# EAGLE design power_suply_unit (EAGLE 9.4.2)
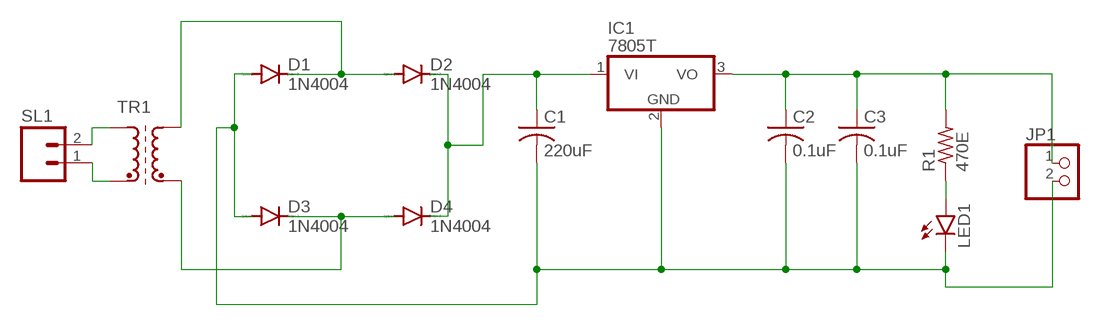
[diagram p0: schematic, sheet 1]

## Parts
C1  220uF  C-US025-024X044  [C025-024X044]
C2  0.1uF  C-US025-024X044  [C025-024X044]
C3  0.1uF  C-US025-024X044  [C025-024X044]
D1  1N4004  [DO41-10]
D2  1N4004  [DO41-10]
D3  1N4004  [DO41-10]
D4  1N4004  [DO41-10]
IC1  7805T  [TO220H]
JP1  PINHD-1X2  [1X02]
LED1  LED3MM  [LED3MM]
R1  470E  R-US_0204/7  [0204/7]
SL1  M02  [02P]
TR1  SM-T4  [SM-T4]

## Nets
N$1: SL1.2 TR1.1(A1)
N$2: SL1.1 TR1.2(E1)
N$3: D1.C D2.A TR1.5(A2)
N$4: D3.C D4.A TR1.4(E2)
N$6: C1.1 D2.C D4.C IC1.1(VI)
N$7: LED1.A R1.1
N$8: C2.1 C3.1 IC1.3(VO) JP1.1 R1.2
N$9: C1.2 C2.2 C3.2 D1.A D3.A IC1.2(GND) JP1.2 LED1.K(C)

## Library data of the parts
C1-C3 = rcl:C-US: CAPACITOR, American symbol; SPICEPREFIX: C
D1-D4 = diode:1N4004: DIODE general purpose rectifier, 1 A
IC1 = linear:78*: Positive VOLTAGE REGULATOR Source: http://cache.national.com/ds/LM/LM78L05.pdf http://www.fairchildsemi.com/ds/LM/LM7805.pdf
JP1 = pinhead:PINHD-1X2: PIN HEADER
LED1 = led:LED: LED OSRAM: - CHIPLED LG R971, LG N971, LY N971, LG Q971, LY Q971, LO R971, LY R971 LH N974, LH R974 LS Q976, LO Q976, LY Q976 LO Q996 - Hyper CHIPLED LW Q18S LB Q993, LB Q99A, LB R99A - SideLED LS A670, LO A670, LY A670, LG A670, LP A670 LB A673, LV A673, LT A673, LW A673 LH A674 LY A675 LS A676, LA A676, LO A676, LY A676, LW A676 LS A679, LY A679, LG A679 - Hyper Micro SIDELED® LS Y876, LA Y876, LO Y876, LY Y876 LT Y87S - SmartLED LW L88C, LW L88S LB L89C, LB L89S, LG L890 LS L89K, LO L89K, LY L89K LS L896, LA L896, LO L896, LY L896 - TOPLED LS T670, LO T670, LY T670, LG T670, LP T670 LSG T670, LSP T670, LSY T670, LOP T670, LYG T670 LG T671, LOG T671, LSG T671 LB T673, LV T673, LT T673, LW T673 LH T674 LS T676, LA T676, LO T676, LY T676, LB T676, LH T676, LSB T676, LW T676 LB T67C, LV T67C, LT T67C, LS T67K, LO T67K, LY T67K, LW E67C LS E67B, LA E67B, LO E67B, LY E67B, LB E67C, LV E67C, LT E67C LW T67C LS T679, LY T679, LG T679 LS T770, LO T770, LY T770, LG T770, LP T770 LB T773, LV T773, LT T773, LW T773 LH T774 LS E675, LA E675, LY E675, LS T675 LS T776, LA T776, LO T776, LY T776, LB T776 LHGB T686 LT T68C, LB T68C - Hyper Mini TOPLED® LB M676 - Mini TOPLED Santana® LG M470 LS M47K, LO M47K, LY M47K Source: http://www.osram.convergy.de LUXEON: - LUMILED® LXK2-PW12-R00, LXK2-PW12-S00, LXK2-PW14-U00, LXK2-PW14-V00 LXK2-PM12-R00, LXK2-PM12-S00, LXK2-PM14-U00 LXK2-PE12-Q00, LXK2-PE12-R00, LXK2-PE12-S00, LXK2-PE14-T00, LXK2-PE14-U00 LXK2-PB12-K00, LXK2-PB12-L00, LXK2-PB12-M00, LXK2-PB14-N00, LXK2-PB14-P00, LXK2-PB14-Q00 LXK2-PR12-L00, LXK2-PR12-M00, LXK2-PR14-Q00, LXK2-PR14-R00 LXK2-PD12-Q00, LXK2-PD12-R00, LXK2-PD12-S00 LXK2-PH12-R00, LXK2-PH12-S00 LXK2-PL12-P00, LXK2-PL12-Q00, LXK2-PL12-R00 Source: www.luxeon.com KINGBRIGHT: KA-3528ASYC Source: www.kingbright.com
R1 = rcl:R-US_: RESISTOR, American symbol; SPICEPREFIX: R
SL1 = con-amp-quick:M02: AMP QUICK CONNECTOR; OC_FARNELL: unknown; OC_NEWARK: unknown
TR1 = inductor-neosid:SM-T4: TRANSFORMER SMD wideband transformer; OC_FARNELL: unknown; OC_NEWARK: unknown

## Board
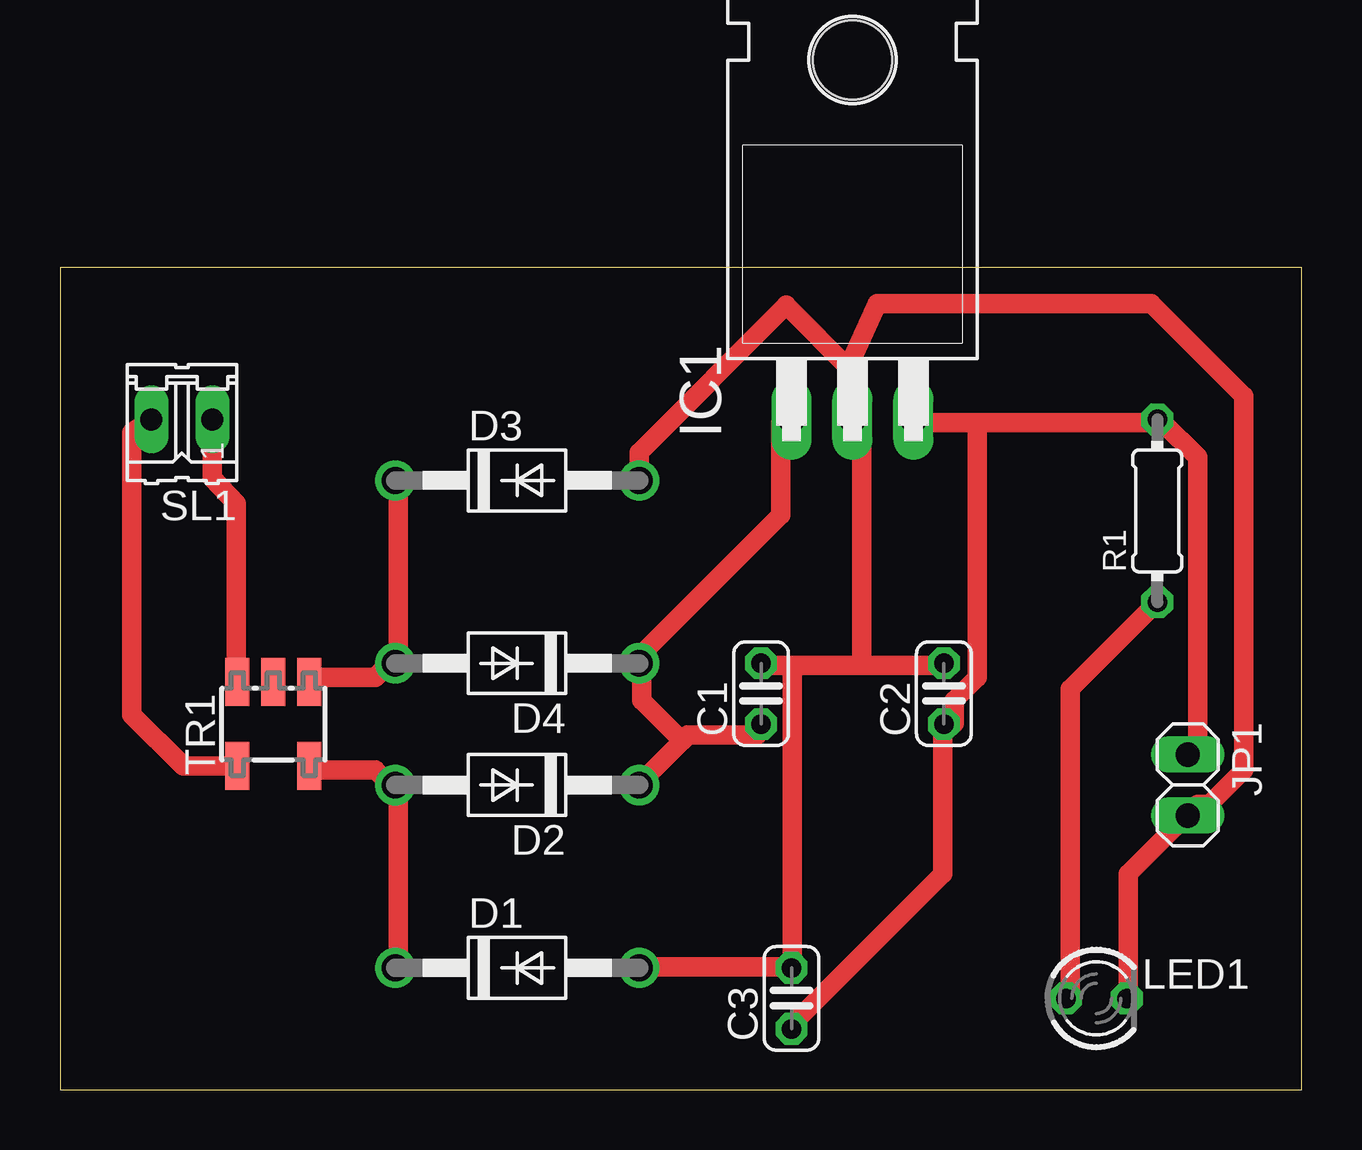
[diagram p1: board, top side]

Size 51.74 x 34.28 mm. Coordinates in mm from the lower left corner, seen from the top.
Outline: 0,0 51.74,0 51.74,34.28 0,34.28 0,0
Copper layers (1*16): Top 0.035mm / dielectric 1.5mm / Bottom 0.035mm
Design rules "default *": minimum track width 32mil, minimum drill 0.35mm, track to track 6mil, track to pad 6mil, pad to pad 6mil, via to via 6mil, smd to smd 6mil, copper to edge 40mil, drill to drill 6mil, minimum pad ring 10mil, minimum via ring 8mil, stop-mask expansion 4mil, vias tented up to drill 0mil, thermal gap 10mil

### Footprints (pad centres in the part's own frame; a part is rotated, then mirrored left to right if it is on the bottom)
C025-024X044 = drill 0.813 octagon: 1 -1.27,0; 2 1.27,0
DO41-10 = drill 1.118: A 5.08,0; C -5.08,0
TO220H = drill 1.118 long: 1 -2.54,-10.16; 2 0,-10.16; 3 2.54,-10.16 | hole 3.302: 0,4.826
1X02 = drill 1.016 long: 1 -1.27,0; 2 1.27,0
LED3MM = drill 0.813 octagon: A -1.27,0; K 1.27,0
0204/7 = drill 0.813 octagon: 1 -3.81,0; 2 3.81,0
02P = drill 0.914 long: 1 -1.27,0; 2 1.27,0
SM-T4 = smd 1 x 2: 1 -1.5,-1.75; 2 -1.5,1.75; 3 0,1.75; 4 1.5,1.75; 5 1.5,-1.75

### Placement (x,y rotation side)
C1  29.21,16.51 90 top
C2  36.83,16.51 90 top
C3  30.48,3.81 90 top
D1  19.05,5.08 0 top
D2  19.05,12.7 180 top
D3  19.05,25.4 0 top
D4  19.05,17.78 180 top
IC1  33.02,38.1 0 top
JP1  46.99,12.7 270 top
LED1  43.18,3.81 0 top
R1  45.72,24.13 90 top
SL1  5.08,27.94 180 top
TR1  8.89,15.24 0 top

### Tracks (layer width: path | path; a pad name or v marks a point on that pad's centre or on a via)
N$1
  Top 0.813: TR1.1 5.13,13.49 3,15.62 3,27.4 SL1.2
N$2
  Top 0.813: TR1.2 7.34,17.2 7.34,24.43 6.35,25.51 SL1.1
N$3
  Top 0.813: TR1.5 10.72,13.33 13.13,13.33 13.61,12.85 D2.A 14.1,12.37 14.1,5.13 D1.C
N$4
  Top 0.813: TR1.4 10.72,17.2 13.13,17.2 13.61,17.68 D4.A 14.1,18.16 14.1,25.4 D3.C
N$6
  Top 0.813: 25.92,14.54 24.23,12.85 D2.C | 25.92,14.54 26.16,14.78 29.06,14.78 C1.1 | 25.92,14.54 24.23,16.23 24.23,17.68 D4.C 24.23,18.16 30.02,23.95 30.02,27.81 IC1.1
N$7
  Top 0.813: LED1.A 42.09,4.17 42.09,16.71 45.47,20.09 R1.1
N$8
  Top 0.813: C3.1 30.5,2.72 36.78,8.99 36.78,14.78 C2.1 37.26,15.26 37.26,16.23 38.23,17.2 38.23,27.81 | 38.23,27.81 35.81,27.81 IC1.3 | 38.23,27.81 45.47,27.81 R1.2 45.95,27.81 47.4,26.36 47.4,14.3 JP1.1
N$9
  Top 0.813: LED1.K 44.5,4.17 44.5,8.99 46.91,11.4 JP1.2 47.4,11.89 47.88,11.89 49.33,13.33 49.33,28.91 45.47,32.77 34.06,32.77 33.02,30.48 IC1.2 | D1.A 24.23,5.13 30.02,5.13 C3.2 30.5,5.13 30.5,17.68 | 33.4,17.68 36.78,17.68 C2.2 | 33.4,17.68 30.5,17.68 | 30.5,17.68 29.54,17.68 C1.2 | D3.A 24.13,26.57 30.26,32.7 33.02,29.95 IC1.2 | 33.4,17.68 33.4,27.81 IC1.2